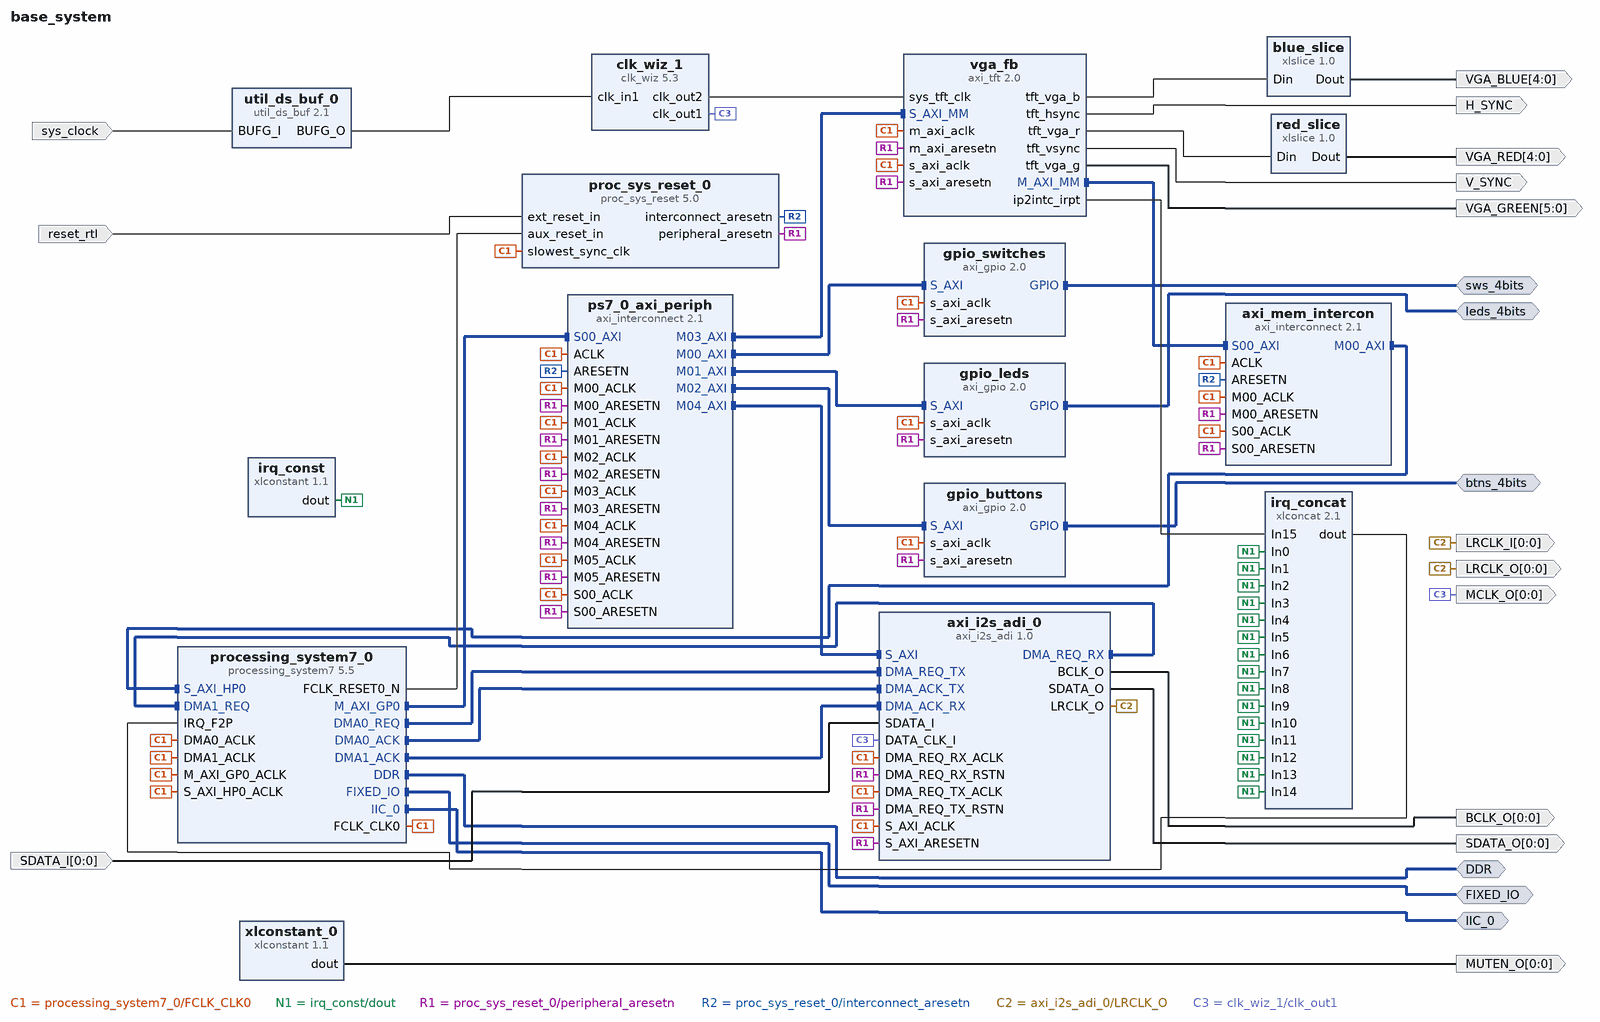
[diagram p0: block diagram of the top level]
# Vivado block design base_system, xc7z010clg400-1, Vivado 2016.4
create_bd_design base_system

create_bd_intf_port -mode Master -vlnv xilinx.com:interface:ddrx_rtl:1.0 DDR
create_bd_intf_port -mode Master -vlnv xilinx.com:display_processing_system7:fixedio_rtl:1.0 FIXED_IO
create_bd_intf_port -mode Master -vlnv xilinx.com:interface:gpio_rtl:1.0 btns_4bits
create_bd_intf_port -mode Master -vlnv xilinx.com:interface:gpio_rtl:1.0 leds_4bits
create_bd_intf_port -mode Master -vlnv xilinx.com:interface:gpio_rtl:1.0 sws_4bits
create_bd_intf_port -mode Master -vlnv xilinx.com:interface:iic_rtl:1.0 IIC_0
create_bd_port -dir I -type rst reset_rtl
set_property -dict {CONFIG.POLARITY ACTIVE_LOW} [get_bd_ports reset_rtl]
create_bd_port -dir O -from 4 -to 0 VGA_BLUE
create_bd_port -dir O -from 4 -to 0 VGA_RED
create_bd_port -dir O -from 5 -to 0 VGA_GREEN
create_bd_port -dir O V_SYNC
create_bd_port -dir O H_SYNC
create_bd_port -dir O -from 0 -to 0 BCLK_O
create_bd_port -dir O -from 0 -to 0 LRCLK_O
create_bd_port -dir O -from 0 -to 0 LRCLK_I
create_bd_port -dir O -from 0 -to 0 SDATA_O
create_bd_port -dir I -from 0 -to 0 SDATA_I
create_bd_port -dir O -from 0 -to 0 MUTEN_O
create_bd_port -dir O -from 0 -to 0 -type clk MCLK_O
create_bd_port -dir I -type clk sys_clock
set_property -dict {CONFIG.FREQ_HZ 125000000 CONFIG.PHASE 0.000} [get_bd_ports sys_clock]

create_bd_cell -type ip -vlnv xilinx.com:ip:processing_system7:5.5 processing_system7_0
set_property -dict [list \
  CONFIG.PCW_UIPARAM_DDR_FREQ_MHZ 525 \
  CONFIG.PCW_CRYSTAL_PERIPHERAL_FREQMHZ 50.000000 \
  CONFIG.PCW_APU_PERIPHERAL_FREQMHZ 650 \
  CONFIG.PCW_SDIO_PERIPHERAL_FREQMHZ 50 \
  CONFIG.PCW_FPGA0_PERIPHERAL_FREQMHZ 100 \
  CONFIG.PCW_FPGA1_PERIPHERAL_FREQMHZ 25 \
  CONFIG.PCW_USE_S_AXI_HP0 1 \
  CONFIG.PCW_USE_DMA0 1 \
  CONFIG.PCW_USE_DMA1 1 \
  CONFIG.PCW_USE_FABRIC_INTERRUPT 1 \
  CONFIG.PCW_USE_HIGH_OCM 1 \
  CONFIG.PCW_IRQ_F2P_INTR 1 \
  CONFIG.PCW_PRESET_BANK1_VOLTAGE {LVCMOS 1.8V} \
  CONFIG.PCW_UIPARAM_DDR_PARTNO {MT41K128M16 JT-125} \
  CONFIG.PCW_QSPI_PERIPHERAL_ENABLE 1 \
  CONFIG.PCW_QSPI_GRP_SINGLE_SS_ENABLE 1 \
  CONFIG.PCW_QSPI_GRP_FBCLK_ENABLE 1 \
  CONFIG.PCW_ENET0_PERIPHERAL_ENABLE 1 \
  CONFIG.PCW_ENET0_ENET0_IO {MIO 16 .. 27} \
  CONFIG.PCW_ENET0_GRP_MDIO_ENABLE 1 \
  CONFIG.PCW_ENET0_RESET_ENABLE 0 \
  CONFIG.PCW_SD0_PERIPHERAL_ENABLE 1 \
  CONFIG.PCW_SD0_GRP_CD_ENABLE 1 \
  CONFIG.PCW_SD0_GRP_CD_IO {MIO 47} \
  CONFIG.PCW_SD0_GRP_WP_ENABLE 1 \
  CONFIG.PCW_UART1_PERIPHERAL_ENABLE 1 \
  CONFIG.PCW_USB0_PERIPHERAL_ENABLE 1 \
  CONFIG.PCW_USB0_RESET_ENABLE 1 \
  CONFIG.PCW_USB0_RESET_IO {MIO 46} \
  CONFIG.PCW_I2C0_PERIPHERAL_ENABLE 1 \
  CONFIG.PCW_GPIO_MIO_GPIO_ENABLE 1 \
] [get_bd_cells processing_system7_0]
# 109 more settings of processing_system7_0 are not shown: defaults, MIO pin electricals, DDR timing, and values the tool derives
create_bd_cell -type ip -vlnv xilinx.com:ip:xlconcat:2.1 irq_concat
set_property -dict {CONFIG.NUM_PORTS 16} [get_bd_cells irq_concat]
create_bd_cell -type ip -vlnv xilinx.com:ip:xlconstant:1.1 irq_const
set_property -dict {CONFIG.CONST_VAL 0} [get_bd_cells irq_const]
create_bd_cell -type ip -vlnv xilinx.com:ip:proc_sys_reset:5.0 proc_sys_reset_0
create_bd_cell -type ip -vlnv xilinx.com:ip:axi_gpio:2.0 gpio_switches
set_property -dict {CONFIG.USE_BOARD_FLOW true CONFIG.GPIO_BOARD_INTERFACE sws_4bits} [get_bd_cells gpio_switches]
create_bd_cell -type ip -vlnv xilinx.com:ip:axi_interconnect:2.1 ps7_0_axi_periph
set_property -dict [list \
  CONFIG.NUM_MI 6 \
  CONFIG.STRATEGY 2 \
  CONFIG.ENABLE_ADVANCED_OPTIONS 0 \
  CONFIG.M03_HAS_REGSLICE 0 \
  CONFIG.M03_HAS_DATA_FIFO 0 \
  CONFIG.S00_HAS_DATA_FIFO 2 \
] [get_bd_cells ps7_0_axi_periph]
create_bd_cell -type ip -vlnv xilinx.com:ip:axi_gpio:2.0 gpio_leds
set_property -dict {CONFIG.C_IS_DUAL 0 CONFIG.USE_BOARD_FLOW true CONFIG.GPIO_BOARD_INTERFACE leds_4bits} [get_bd_cells gpio_leds]
create_bd_cell -type ip -vlnv xilinx.com:ip:axi_gpio:2.0 gpio_buttons
set_property -dict {CONFIG.USE_BOARD_FLOW true CONFIG.GPIO_BOARD_INTERFACE btns_4bits} [get_bd_cells gpio_buttons]
create_bd_cell -type ip -vlnv xilinx.com:ip:axi_tft:2.0 vga_fb
set_property -dict [list \
  CONFIG.C_MAX_BURST_LEN 16 \
  CONFIG.C_M_AXI_DATA_WIDTH 64 \
  CONFIG.C_DEFAULT_TFT_BASE_ADDR 0x00000000F0000000 \
  CONFIG.C_M_AXI_ADDR_WIDTH 32 \
  CONFIG.C_EN_I2C_INTF 0 \
  CONFIG.C_TFT_INTERFACE 0 \
] [get_bd_cells vga_fb]
create_bd_cell -type ip -vlnv xilinx.com:ip:axi_interconnect:2.1 axi_mem_intercon
set_property -dict {CONFIG.NUM_MI 1 CONFIG.ENABLE_ADVANCED_OPTIONS 0} [get_bd_cells axi_mem_intercon]
create_bd_cell -type ip -vlnv xilinx.com:ip:xlslice:1.0 blue_slice
set_property -dict {CONFIG.DOUT_WIDTH 5 CONFIG.DIN_TO 1 CONFIG.DIN_FROM 5 CONFIG.DIN_WIDTH 6} [get_bd_cells blue_slice]
create_bd_cell -type ip -vlnv xilinx.com:ip:xlslice:1.0 red_slice
set_property -dict {CONFIG.DOUT_WIDTH 5 CONFIG.DIN_TO 1 CONFIG.DIN_FROM 5 CONFIG.DIN_WIDTH 6} [get_bd_cells red_slice]
create_bd_cell -type ip -vlnv analog.com:user:axi_i2s_adi:1.0 axi_i2s_adi_0
set_property -dict {CONFIG.C_DMA_TYPE 1} [get_bd_cells axi_i2s_adi_0]
create_bd_cell -type ip -vlnv xilinx.com:ip:xlconstant:1.1 xlconstant_0
create_bd_cell -type ip -vlnv xilinx.com:ip:clk_wiz:5.3 clk_wiz_1
set_property -dict [list \
  CONFIG.CLKOUT2_USED true \
  CONFIG.NUM_OUT_CLKS 2 \
  CONFIG.CLKOUT1_REQUESTED_OUT_FREQ 12.288 \
  CONFIG.CLKOUT2_REQUESTED_OUT_FREQ 25.000 \
  CONFIG.USE_LOCKED false \
  CONFIG.USE_RESET false \
  CONFIG.MMCM_DIVCLK_DIVIDE 5 \
  CONFIG.MMCM_CLKFBOUT_MULT_F 29.000 \
  CONFIG.MMCM_CLKOUT0_DIVIDE_F 59.000 \
  CONFIG.MMCM_CLKOUT1_DIVIDE 29 \
  CONFIG.USE_BOARD_FLOW true \
  CONFIG.CLK_IN1_BOARD_INTERFACE sys_clock \
  CONFIG.CLKOUT1_JITTER 425.475 \
  CONFIG.CLKOUT1_PHASE_ERROR 293.530 \
  CONFIG.CLKOUT2_JITTER 373.811 \
  CONFIG.CLKOUT2_PHASE_ERROR 293.530 \
] [get_bd_cells clk_wiz_1]
create_bd_cell -type ip -vlnv xilinx.com:ip:util_ds_buf:2.1 util_ds_buf_0
set_property -dict {CONFIG.C_BUF_TYPE BUFG} [get_bd_cells util_ds_buf_0]

# ---- connections ----

connect_bd_intf_net [get_bd_intf_pins processing_system7_0/M_AXI_GP0] [get_bd_intf_pins ps7_0_axi_periph/S00_AXI]
connect_bd_intf_net [get_bd_intf_pins ps7_0_axi_periph/M00_AXI] [get_bd_intf_pins gpio_switches/S_AXI]
connect_bd_intf_net [get_bd_intf_pins ps7_0_axi_periph/M01_AXI] [get_bd_intf_pins gpio_leds/S_AXI]
connect_bd_intf_net [get_bd_intf_pins ps7_0_axi_periph/M02_AXI] [get_bd_intf_pins gpio_buttons/S_AXI]
connect_bd_intf_net [get_bd_intf_pins ps7_0_axi_periph/M03_AXI] [get_bd_intf_pins vga_fb/S_AXI_MM]
connect_bd_intf_net [get_bd_intf_pins vga_fb/M_AXI_MM] [get_bd_intf_pins axi_mem_intercon/S00_AXI]
connect_bd_intf_net [get_bd_intf_pins axi_mem_intercon/M00_AXI] [get_bd_intf_pins processing_system7_0/S_AXI_HP0]
connect_bd_intf_net [get_bd_intf_pins ps7_0_axi_periph/M04_AXI] [get_bd_intf_pins axi_i2s_adi_0/S_AXI]
connect_bd_intf_net [get_bd_intf_pins processing_system7_0/DMA0_REQ] [get_bd_intf_pins axi_i2s_adi_0/DMA_REQ_TX]
connect_bd_intf_net [get_bd_intf_pins processing_system7_0/DMA0_ACK] [get_bd_intf_pins axi_i2s_adi_0/DMA_ACK_TX]
connect_bd_intf_net [get_bd_intf_pins processing_system7_0/DMA1_ACK] [get_bd_intf_pins axi_i2s_adi_0/DMA_ACK_RX]
connect_bd_intf_net [get_bd_intf_pins axi_i2s_adi_0/DMA_REQ_RX] [get_bd_intf_pins processing_system7_0/DMA1_REQ]
connect_bd_intf_net [get_bd_intf_ports DDR] [get_bd_intf_pins processing_system7_0/DDR]
connect_bd_intf_net [get_bd_intf_ports FIXED_IO] [get_bd_intf_pins processing_system7_0/FIXED_IO]
connect_bd_intf_net -intf_net axi_gpio_2_GPIO [get_bd_intf_ports btns_4bits] [get_bd_intf_pins gpio_buttons/GPIO]
connect_bd_intf_net -intf_net axi_gpio_1_GPIO [get_bd_intf_ports leds_4bits] [get_bd_intf_pins gpio_leds/GPIO]
connect_bd_intf_net -intf_net axi_gpio_0_GPIO [get_bd_intf_ports sws_4bits] [get_bd_intf_pins gpio_switches/GPIO]
connect_bd_intf_net [get_bd_intf_ports IIC_0] [get_bd_intf_pins processing_system7_0/IIC_0]
connect_bd_net [get_bd_pins processing_system7_0/FCLK_CLK0] \
  [get_bd_pins processing_system7_0/M_AXI_GP0_ACLK] [get_bd_pins proc_sys_reset_0/slowest_sync_clk] \
  [get_bd_pins gpio_switches/s_axi_aclk] [get_bd_pins gpio_leds/s_axi_aclk] [get_bd_pins gpio_buttons/s_axi_aclk] \
  [get_bd_pins vga_fb/m_axi_aclk] [get_bd_pins vga_fb/s_axi_aclk] [get_bd_pins processing_system7_0/S_AXI_HP0_ACLK] \
  [get_bd_pins axi_i2s_adi_0/S_AXI_ACLK] [get_bd_pins axi_i2s_adi_0/DMA_REQ_TX_ACLK] \
  [get_bd_pins axi_i2s_adi_0/DMA_REQ_RX_ACLK] [get_bd_pins processing_system7_0/DMA0_ACLK] \
  [get_bd_pins processing_system7_0/DMA1_ACLK] [get_bd_pins ps7_0_axi_periph/S00_ACLK] [get_bd_pins ps7_0_axi_periph/ACLK] \
  [get_bd_pins ps7_0_axi_periph/M00_ACLK] [get_bd_pins ps7_0_axi_periph/M01_ACLK] [get_bd_pins ps7_0_axi_periph/M02_ACLK] \
  [get_bd_pins axi_mem_intercon/S00_ACLK] [get_bd_pins axi_mem_intercon/ACLK] [get_bd_pins axi_mem_intercon/M00_ACLK] \
  [get_bd_pins ps7_0_axi_periph/M03_ACLK] [get_bd_pins ps7_0_axi_periph/M04_ACLK] [get_bd_pins ps7_0_axi_periph/M05_ACLK]
connect_bd_net [get_bd_pins irq_concat/dout] [get_bd_pins processing_system7_0/IRQ_F2P]
connect_bd_net [get_bd_pins irq_const/dout] \
  [get_bd_pins irq_concat/In0] [get_bd_pins irq_concat/In1] [get_bd_pins irq_concat/In2] [get_bd_pins irq_concat/In3] \
  [get_bd_pins irq_concat/In4] [get_bd_pins irq_concat/In5] [get_bd_pins irq_concat/In6] [get_bd_pins irq_concat/In7] \
  [get_bd_pins irq_concat/In8] [get_bd_pins irq_concat/In9] [get_bd_pins irq_concat/In10] [get_bd_pins irq_concat/In11] \
  [get_bd_pins irq_concat/In12] [get_bd_pins irq_concat/In13] [get_bd_pins irq_concat/In14]
connect_bd_net [get_bd_pins processing_system7_0/FCLK_RESET0_N] [get_bd_pins proc_sys_reset_0/aux_reset_in]
connect_bd_net [get_bd_ports reset_rtl] [get_bd_pins proc_sys_reset_0/ext_reset_in]
connect_bd_net [get_bd_pins proc_sys_reset_0/peripheral_aresetn] \
  [get_bd_pins gpio_switches/s_axi_aresetn] [get_bd_pins gpio_leds/s_axi_aresetn] [get_bd_pins gpio_buttons/s_axi_aresetn] \
  [get_bd_pins vga_fb/m_axi_aresetn] [get_bd_pins vga_fb/s_axi_aresetn] [get_bd_pins axi_i2s_adi_0/S_AXI_ARESETN] \
  [get_bd_pins axi_i2s_adi_0/DMA_REQ_TX_RSTN] [get_bd_pins axi_i2s_adi_0/DMA_REQ_RX_RSTN] \
  [get_bd_pins ps7_0_axi_periph/S00_ARESETN] [get_bd_pins ps7_0_axi_periph/M00_ARESETN] \
  [get_bd_pins ps7_0_axi_periph/M01_ARESETN] [get_bd_pins ps7_0_axi_periph/M02_ARESETN] \
  [get_bd_pins axi_mem_intercon/S00_ARESETN] [get_bd_pins axi_mem_intercon/M00_ARESETN] \
  [get_bd_pins ps7_0_axi_periph/M03_ARESETN] [get_bd_pins ps7_0_axi_periph/M04_ARESETN] \
  [get_bd_pins ps7_0_axi_periph/M05_ARESETN]
connect_bd_net [get_bd_pins proc_sys_reset_0/interconnect_aresetn] [get_bd_pins ps7_0_axi_periph/ARESETN] [get_bd_pins axi_mem_intercon/ARESETN]
connect_bd_net [get_bd_pins blue_slice/Dout] [get_bd_ports VGA_BLUE]
connect_bd_net [get_bd_pins red_slice/Dout] [get_bd_ports VGA_RED]
connect_bd_net -net axi_tft_0_ip2intc_irpt [get_bd_pins vga_fb/ip2intc_irpt] [get_bd_pins irq_concat/In15]
connect_bd_net [get_bd_pins vga_fb/tft_vga_b] [get_bd_pins blue_slice/Din]
connect_bd_net [get_bd_pins vga_fb/tft_vga_r] [get_bd_pins red_slice/Din]
connect_bd_net [get_bd_pins vga_fb/tft_vga_g] [get_bd_ports VGA_GREEN]
connect_bd_net -net v_tc_0_vsync_out [get_bd_pins vga_fb/tft_vsync] [get_bd_ports V_SYNC]
connect_bd_net -net v_tc_0_hsync_out [get_bd_pins vga_fb/tft_hsync] [get_bd_ports H_SYNC]
connect_bd_net [get_bd_pins axi_i2s_adi_0/BCLK_O] [get_bd_ports BCLK_O]
connect_bd_net [get_bd_pins axi_i2s_adi_0/LRCLK_O] [get_bd_ports LRCLK_I] [get_bd_ports LRCLK_O]
connect_bd_net [get_bd_pins axi_i2s_adi_0/SDATA_O] [get_bd_ports SDATA_O]
connect_bd_net [get_bd_ports SDATA_I] [get_bd_pins axi_i2s_adi_0/SDATA_I]
connect_bd_net [get_bd_pins xlconstant_0/dout] [get_bd_ports MUTEN_O]
connect_bd_net -net util_ds_buf_0_BUFG_O [get_bd_pins clk_wiz_1/clk_out1] [get_bd_ports MCLK_O] [get_bd_pins axi_i2s_adi_0/DATA_CLK_I]
connect_bd_net [get_bd_pins util_ds_buf_0/BUFG_O] [get_bd_pins clk_wiz_1/clk_in1]
connect_bd_net [get_bd_ports sys_clock] [get_bd_pins util_ds_buf_0/BUFG_I]
connect_bd_net [get_bd_pins clk_wiz_1/clk_out2] [get_bd_pins vga_fb/sys_tft_clk]

# ---- address map ----
assign_bd_address -offset 0x41200000 -range 64K -target_address_space [get_bd_addr_spaces processing_system7_0/Data] [get_bd_addr_segs gpio_switches/S_AXI/Reg]
assign_bd_address -offset 0x41210000 -range 64K -target_address_space [get_bd_addr_spaces processing_system7_0/Data] [get_bd_addr_segs gpio_leds/S_AXI/Reg]
assign_bd_address -offset 0x41220000 -range 64K -target_address_space [get_bd_addr_spaces processing_system7_0/Data] [get_bd_addr_segs gpio_buttons/S_AXI/Reg]
assign_bd_address -offset 0x43C00000 -range 64K -target_address_space [get_bd_addr_spaces processing_system7_0/Data] [get_bd_addr_segs axi_i2s_adi_0/S_AXI/reg0]
assign_bd_address -offset 0x44A00000 -range 64K -target_address_space [get_bd_addr_spaces processing_system7_0/Data] [get_bd_addr_segs vga_fb/S_AXI_MM/Reg]
assign_bd_address -offset 0x00000000 -range 512M -target_address_space [get_bd_addr_spaces vga_fb/Video_data] [get_bd_addr_segs processing_system7_0/S_AXI_HP0/HP0_DDR_LOWOCM]
assign_bd_address -offset 0xFFFC0000 -range 256K -target_address_space [get_bd_addr_spaces vga_fb/Video_data] [get_bd_addr_segs processing_system7_0/S_AXI_HP0/HP0_HIGH_OCM]

validate_bd_design
save_bd_design
